# EAGLE design ZXS_I2_kartridz (EAGLE 8.6.3)
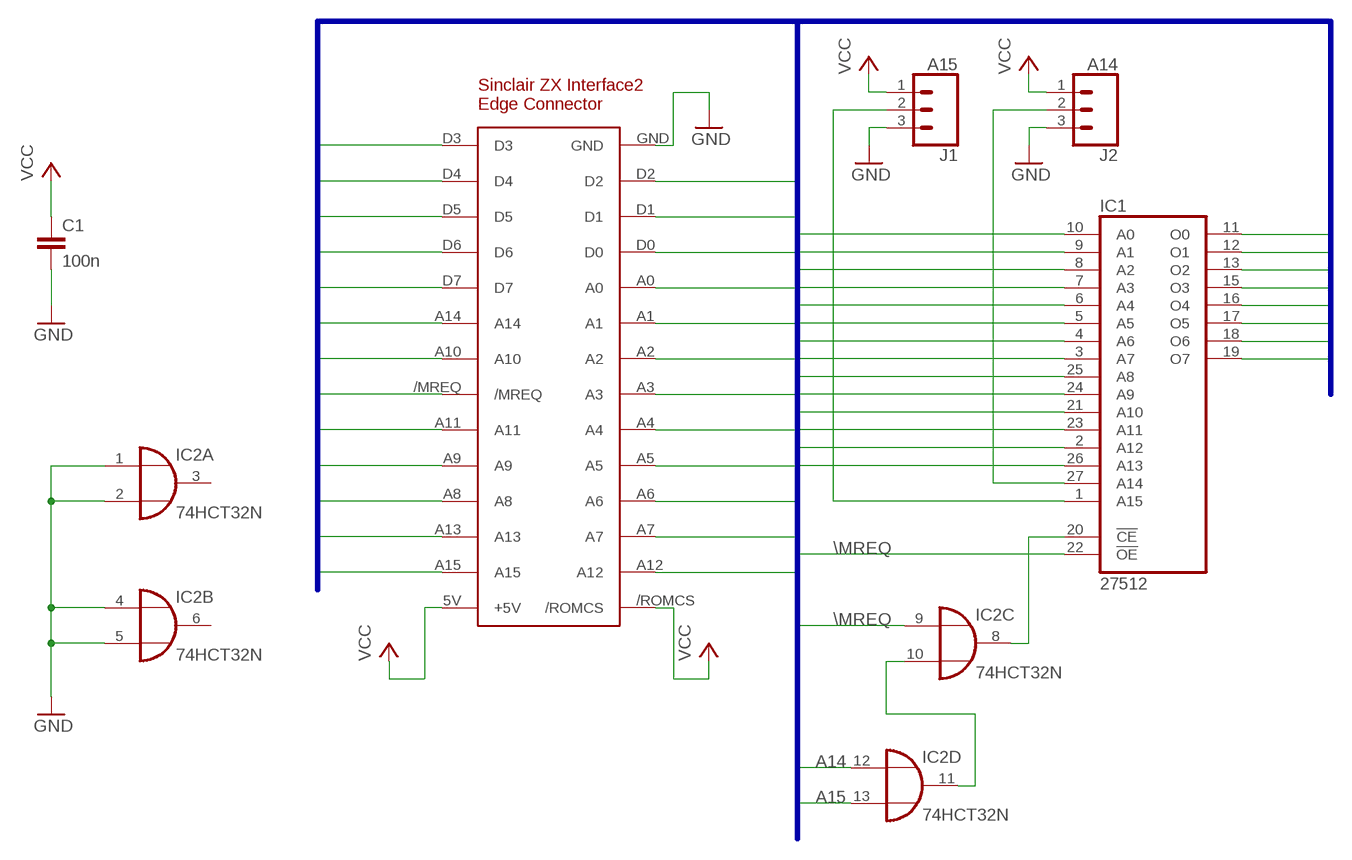
[diagram p0: schematic, sheet 1]

## Parts
C1  100n  C-EU050-024X044  [C050-024X044]
IC1  27512  [DIL28]
IC2  74HCT32N  [DIL14]
J1  A15  CONN_03  [1X03]
J2  A14  CONN_03  [1X03]
U$1  ZX_I2_ROM_EDGE_CONNECTOR  [ZX_I2_ROM_EDGE_CONNECTOR_V2]

## Nets
\MREQ: IC1.22(!OE) IC2.9(C:I0) U$1./MREQ
A0: IC1.10(A0) U$1.A0
A1: IC1.9(A1) U$1.A1
A2: IC1.8(A2) U$1.A2
A3: IC1.7(A3) U$1.A3
A4: IC1.6(A4) U$1.A4
A5: IC1.5(A5) U$1.A5
A6: IC1.4(A6) U$1.A6
A7: IC1.3(A7) U$1.A7
A8: IC1.25(A8) U$1.A8
A9: IC1.24(A9) U$1.A9
A10: IC1.21(A10) U$1.A10
A11: IC1.23(A11) U$1.A11
A12: IC1.2(A12) U$1.A12
A13: IC1.26(A13) U$1.A13
A14: IC2.12(D:I0) U$1.A14
A15: IC2.13(D:I1) U$1.A15
D0: IC1.11(O0) U$1.D0
D1: IC1.12(O1) U$1.D1
D2: IC1.13(O2) U$1.D2
D3: IC1.15(O3) U$1.D3
D4: IC1.16(O4) U$1.D4
D5: IC1.17(O5) U$1.D5
D6: IC1.18(O6) U$1.D6
D7: IC1.19(O7) U$1.D7
GND: C1.2 IC2.1(A:I0) IC2.2(A:I1) IC2.4(B:I0) IC2.5(B:I1) J1.3 J2.3 U$1.GND
N$1: IC2.10(C:I1) IC2.11(D:O)
N$2: IC1.27(A14) J2.2
N$3: IC1.20(!CE) IC2.8(C:O)
N$4: IC1.1(A15) J1.2
VCC: C1.1 J1.1 J2.1 U$1.5V(+5V) U$1./ROMCS
Unconnected: IC2.3(A:O) IC2.6(B:O)

## Buses
A[0..15],D[0..7],\MREQ

## Power pins joined to a net without a drawn wire
GND: IC1.14(GND) IC2.7(P:GND)
VCC: IC1.28(VCC) IC2.14(P:VCC)

## Library data of the parts
C1 = rcl:C-EU: CAPACITOR, European symbol; SPICEPREFIX: C
IC1 = memory:27512: MEMORY
IC2 = 74xx-eu:74*32: Quad 2-input OR gate
J1 J2 = SparkFun-Connectors:CONN_03: Multi connection point. Often used as Generic Header-pin footprint for 0.1 inch spaced/style header connections On any of the 0.1 inch spaced packages, you can populate with these: Break Away Headers - Straight <https://www.sparkfun.com/products/116> (PRT-00116) Break Away Male Headers - Right Angle <https://www.sparkfun.com/products/553> (PRT-00553) Female Headers <https://www.sparkfun.com/products/115> (PRT-00115) Break Away Headers - Machine Pin <https://www.sparkfun.com/products/117> (PRT-00117) Break Away Female Headers - Swiss Machine Pin <https://www.sparkfun.com/products/743> (PRT-00743) Stackable Header - 3 Pin (Female, 0.1") <https://www.sparkfun.com/products/13875> (PRT-13875) For SCREWTERMINALS and SPRING TERMINALS visit here: Screw Terimnals on SparkFun.com <https://www.sparkfun.com/search/results?term=Screw+Terminals> (5mm/3.5mm/2.54mm spacing) This device is also useful as a general connection point to wire up your design to another part of your project. Our various solder wires solder well into these plated through hole pads. Hook-Up Wire - Assortment (Stranded, 22 AWG) <https://www.sparkfun.com/products/11375> (PRT-11375) Hook-Up Wire - Assortment (Solid Core, 22 AWG) <https://www.sparkfun.com/products/11367> (PRT-11367) View the entire wire category on our website here <https://www.sparkfun.com/categories/141> Special notes: Molex polarized connector foot print use with SKU : PRT-08232 with associated crimp pins and housings.
U$1 = zxs_i2_rom_edge_connector:ZX_I2_ROM_EDGE_CONNECTOR

## Board
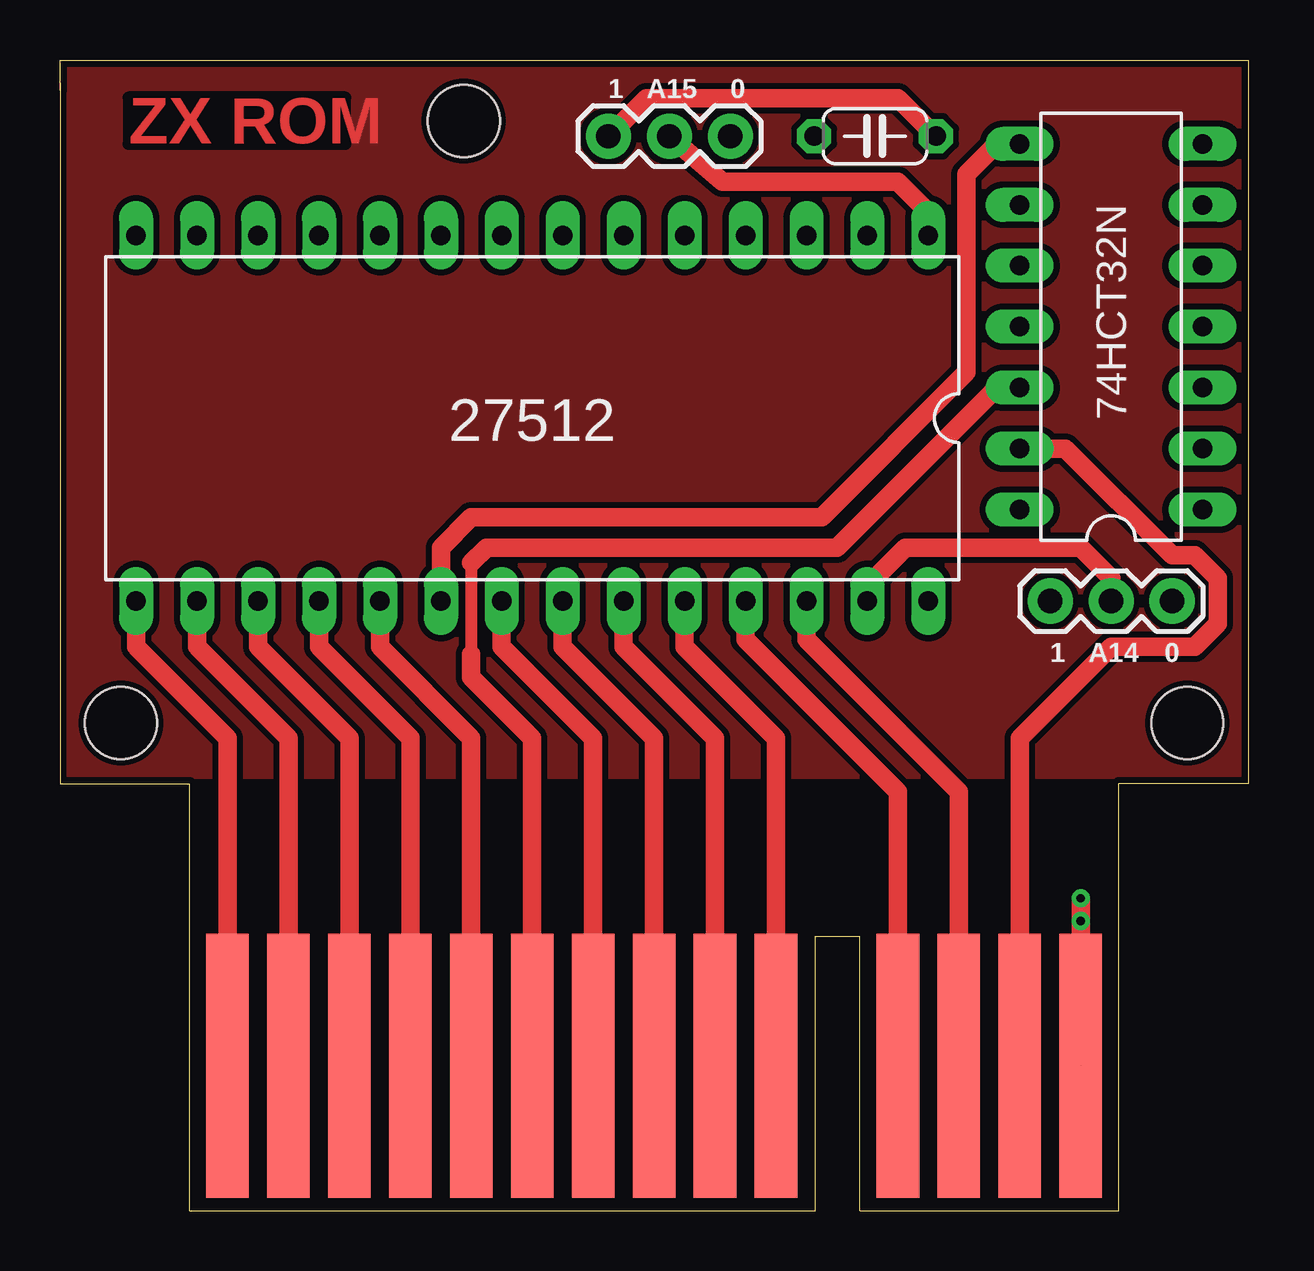
[diagram p1: board, top side]
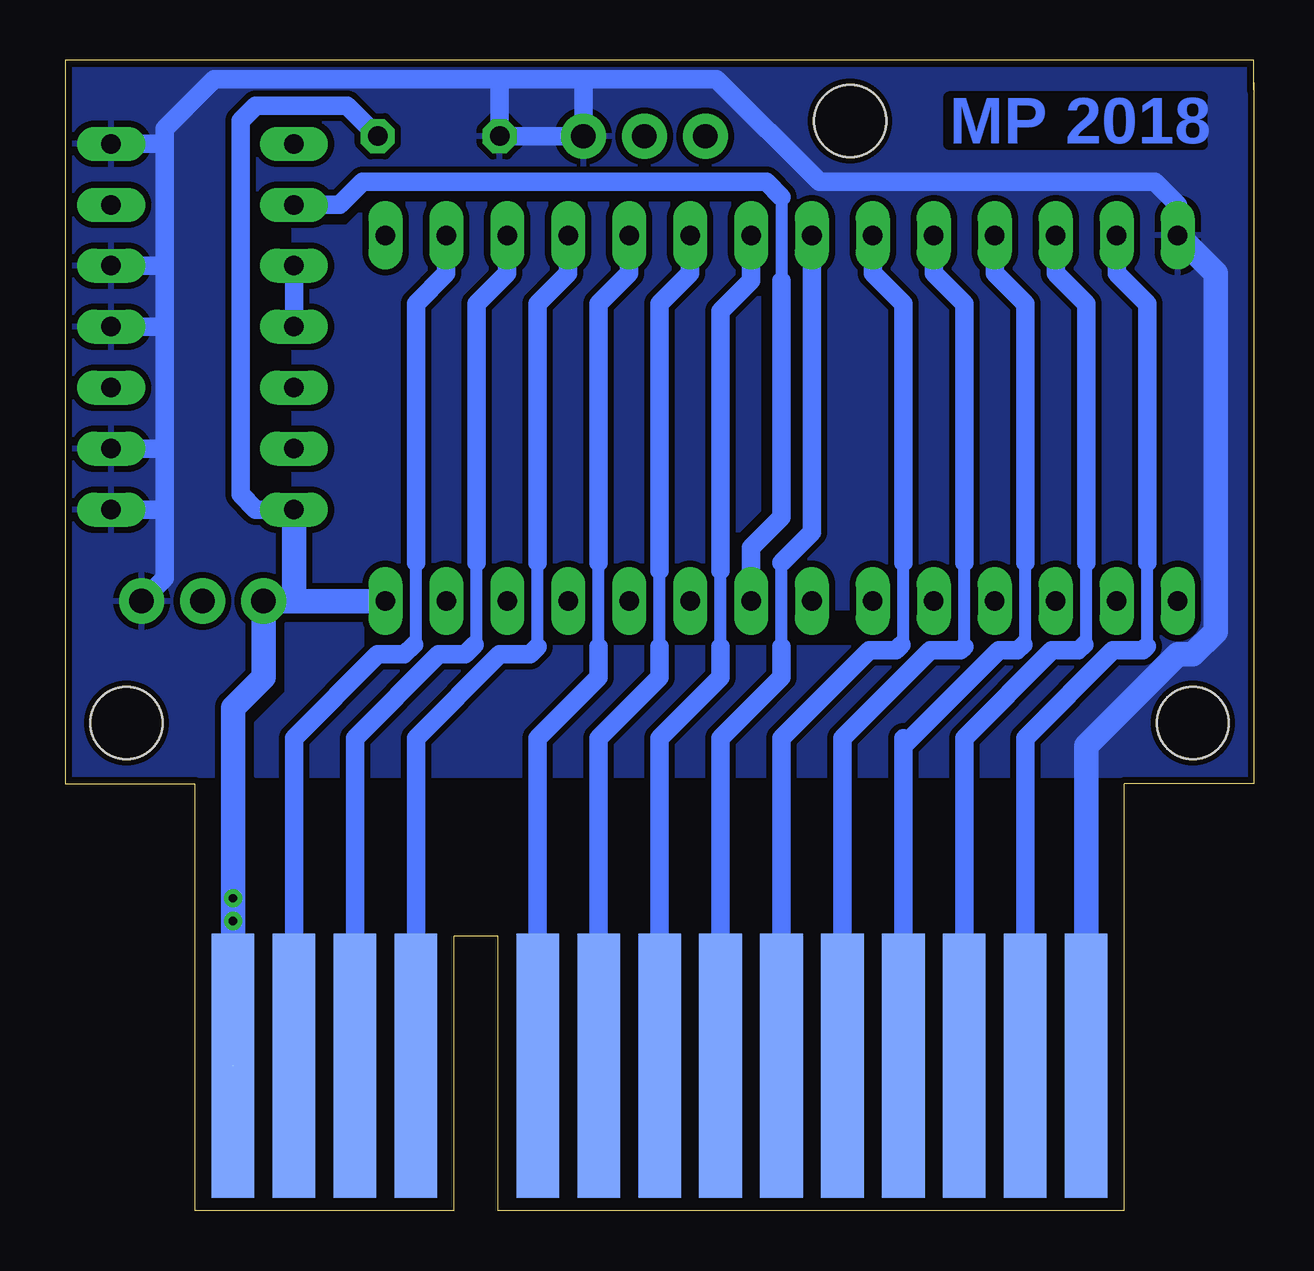
[diagram p2: board, bottom side, seen from below]

Size 49.53 x 47.94 mm. Coordinates in mm from the lower left corner, seen from the top.
Outline: 0,46.99 0,46.67
Outline: 0,46.67 0,17.78 5.4,17.78 5.4,0 31.5,0 31.5,11.43 33.34,11.43 33.34,0 44.13,0 44.13,17.78 49.53,17.78 49.53,47.94 0,47.94 0,46.67
Copper layers (1*16): Top 0.035mm / dielectric 1.5mm / Bottom 0.035mm
Design rules "moje_1 *": minimum track width 10mil, minimum drill 0.35mm, track to track 10mil, track to pad 10mil, pad to pad 10mil, via to via 10mil, smd to smd 6mil, copper to edge 10mil, drill to drill 6mil, minimum pad ring 12mil, minimum via ring 8mil, stop-mask expansion 4mil, vias tented up to drill 0mil, thermal gap 10mil
Holes 3 mm at 2.54,20.32 46.99,20.32 16.83,45.4

### Footprints (pad centres in the part's own frame; a part is rotated, then mirrored left to right if it is on the bottom)
C050-024X044 = drill 0.813 octagon: 1 -2.54,0; 2 2.54,0
DIL28 = drill 0.813 long: 1 -16.51,-7.62; 2 -13.97,-7.62; 3 -11.43,-7.62; 4 -8.89,-7.62; 5 -6.35,-7.62; 6 -3.81,-7.62; 7 -1.27,-7.62; 8 1.27,-7.62; 9 3.81,-7.62; 10 6.35,-7.62; 11 8.89,-7.62; 12 11.43,-7.62; 13 13.97,-7.62; 14 16.51,-7.62; 15 16.51,7.62; 16 13.97,7.62; 17 11.43,7.62; 18 8.89,7.62; 19 6.35,7.62; 20 3.81,7.62; 21 1.27,7.62; 22 -1.27,7.62; 23 -3.81,7.62; 24 -6.35,7.62; 25 -8.89,7.62; 26 -11.43,7.62; 27 -13.97,7.62; 28 -16.51,7.62
DIL14 = drill 0.813 long: 1 -7.62,-3.81; 2 -5.08,-3.81; 3 -2.54,-3.81; 4 0,-3.81; 5 2.54,-3.81; 6 5.08,-3.81; 7 7.62,-3.81; 8 7.62,3.81; 9 5.08,3.81; 10 2.54,3.81; 11 0,3.81; 12 -2.54,3.81; 13 -5.08,3.81; 14 -7.62,3.81
1X03 = drill 1.016 pad 1.88: 1 0,0; 2 2.54,0; 3 5.08,0
ZX_I2_ROM_EDGE_CONNECTOR_V2 = smd 1.778 x 11: 5V 10.16,5.08; /MREQ -7.62,5.08; A8 2.54,5.08; A9 -2.54,5.08; A10 -10.16,5.08; A11 -5.08,5.08; A13 5.08,5.08; A14 -12.7,5.08; A15 7.62,5.08; D3 -25.4,5.08; D4 -22.86,5.08; D5 -20.32,5.08; D6 -17.78,5.08; D7 -15.24,5.08 | smd 1.778 x 11 bottom: /ROMCS 10.16,5.08; A0 -15.24,5.08; A1 -12.7,5.08; A2 -10.16,5.08; A3 -7.62,5.08; A4 -5.08,5.08; A5 -2.54,5.08; A6 2.54,5.08; A7 5.08,5.08; A12 7.62,5.08; D0 -17.78,5.08; D1 -20.32,5.08; D2 -22.86,5.08; GND -25.4,5.08

### Placement (x,y rotation side)
C1  33.97,44.77 180 top
IC1  19.68,33.02 180 top
IC2  43.81,36.83 90 top
J1  22.86,44.77 0 top
J2  41.27,25.4 0 top
U$1  32.38,0.95 0 top

### Tracks (layer width: path | path; a pad name or v marks a point on that pad's centre or on a via)
\MREQ
  Top 0.762: U$1./MREQ 24.77,19.68 20.95,23.5 IC1.22
  Bottom 0.508: 19.68,42.23 19.68,38.73
  Bottom 0.762: IC1.22 20.95,27.62 19.68,28.89 19.68,38.73 | 19.68,42.23 20.32,42.86 37.15,42.86 38.1,41.91 IC2.9
A0
  Bottom 0.508: 12.06,23.5 12.06,26.99
  Bottom 0.762: U$1.A0 17.14,19.68 13.49,23.34 12.22,23.34 12.06,23.5 | 12.06,26.99 12.06,37.78 13.34,39.05 IC1.10
A1
  Bottom 0.508: 14.69,23.58 14.61,23.66 14.61,26.99
  Bottom 0.762: U$1.A1 19.68,19.68 16.03,23.34 14.92,23.34 14.69,23.58 | 14.61,26.99 14.61,37.78 15.88,39.05 IC1.9
A2
  Bottom 0.508: 19.68,23.5 19.68,26.99
  Bottom 0.762: U$1.A2 22.23,19.68 19.68,22.23 19.68,23.5 | 19.68,26.99 18.41,28.26 IC1.8
A3
  Bottom 0.508: 22.23,23.5 22.23,26.67 22.23,26.99
  Bottom 0.762: U$1.A3 24.77,19.68 22.23,22.23 22.23,23.5 | 22.23,26.67 22.23,37.47 20.95,38.73 IC1.7
A4
  Bottom 0.508: 24.77,23.5 24.77,26.67 24.77,26.99
  Bottom 0.762: 26.99,6.35 U$1.A4 27.3,19.68 24.77,22.23 24.77,23.5 | 24.77,26.67 24.77,37.78 23.5,39.05 IC1.6
A5
  Bottom 0.508: 27.3,23.5 27.3,26.99
  Bottom 0.762: U$1.A5 29.84,19.68 27.3,22.23 27.3,23.5 | 27.3,26.99 27.3,37.78 26.04,39.05 IC1.5
A6
  Bottom 0.508: 29.84,23.5 29.84,26.99
  Bottom 0.762: U$1.A6 34.92,19.68 31.43,23.18 30.16,23.18 29.84,23.5 | 29.84,26.99 29.84,37.78 28.57,39.05 IC1.4
A7
  Bottom 0.508: 32.47,23.58 32.38,23.66 32.38,26.99
  Bottom 0.762: U$1.A7 37.47,19.68 33.97,23.18 32.87,23.18 32.47,23.58 | 32.38,26.99 32.38,37.78 31.11,39.05 IC1.3
A8
  Top 0.762: U$1.A8 34.92,17.46 28.57,23.81 IC1.25
A9
  Top 0.762: U$1.A9 29.84,19.68 26.04,23.5 IC1.24
A10
  Top 0.762: U$1.A10 22.23,19.68 18.41,23.5 IC1.21
A11
  Top 0.762: U$1.A11 27.3,19.68 23.5,23.5 IC1.23
A12
  Bottom 0.508: 35.01,23.58 34.92,23.66 34.92,26.99
  Bottom 0.762: U$1.A12 40.01,19.68 36.51,23.18 35.41,23.18 35.01,23.58 | 34.92,26.99 34.92,37.78 33.66,39.05 IC1.2
A13
  Top 0.762: U$1.A13 37.47,17.46 31.11,23.81 IC1.26
A14
  Top 0.508: 17.14,26.99 17.14,23.18
  Top 0.762: U$1.A14 19.68,19.68 17.14,22.23 17.14,23.18 | 17.14,26.99 17.78,27.62 32.38,27.62 39.05,34.29 IC2.12
A15
  Top 0.762: U$1.A15 40.01,19.68 43.81,23.5 47.31,23.5 48.26,24.45 48.26,26.35 47.31,27.3 46.35,27.3 41.91,31.75 IC2.13
D0
  Bottom 0.508: 9.61,23.58 9.53,23.66 9.53,26.99
  Bottom 0.762: U$1.D0 14.61,19.37 | 14.61,19.37 14.61,19.68 | 14.61,19.37 10.63,23.34 9.84,23.34 9.61,23.58 | 9.53,26.99 9.53,37.78 10.79,39.05 IC1.11
D1
  Bottom 0.508: 7.3,23.34 6.99,23.66 6.99,26.99
  Bottom 0.762: U$1.D1 12.06,19.68 8.41,23.34 7.3,23.34 7.07,23.58 | 6.99,26.99 6.99,37.78 8.26,39.05 IC1.12
D2
  Bottom 0.508: 4.46,23.51 4.45,23.52 4.45,26.99
  Bottom 0.762: U$1.D2 9.53,19.68 5.87,23.34 4.63,23.34 4.46,23.51 | 4.45,26.99 4.45,37.78 5.71,39.05 IC1.13
D3
  Top 0.762: U$1.D3 6.99,19.68 3.17,23.5 IC1.15
D4
  Top 0.762: U$1.D4 9.53,19.68 5.71,23.5 IC1.16
D5
  Top 0.762: U$1.D5 12.06,19.68 8.26,23.5 IC1.17
D6
  Top 0.762: IC1.18 10.79,23.5 14.61,19.68 U$1.D6
D7
  Top 0.762: U$1.D7 17.14,19.68 13.34,23.5 IC1.19
GND
  Bottom 0.762: J2.3 45.4,26.35 45.4,29.21 | 45.4,29.21 45.4,31.75 | 45.4,31.75 45.4,36.83 | 45.4,36.83 45.4,39.37 | 45.4,39.37 45.4,44.45 | 45.4,44.45 45.4,45.09 43.34,47.15 31.43,47.15 | IC2.7 45.4,44.45 | IC2.5 45.4,39.37 | IC2.4 45.4,36.83 | IC2.2 45.4,31.75 | IC2.1 45.4,29.21 | IC1.14 3.17,41.91 4.13,42.86 18.1,42.86 22.38,47.15 27.94,47.15 | 27.94,47.15 31.43,47.15 | 27.94,47.15 J1.3 C1.2 31.43,47.15
  Bottom 1.016: IC1.14 1.59,39.05 1.59,24.13 2.54,23.18 3.17,23.18 6.99,19.37 U$1.GND
  pour Bottom (isolate 0.254): 0.32,47.62 0.32,18.1 9.53,18.1 9.53,19.68 4.45,24.77 4.45,25.08 22.23,25.08 22.23,26.67 21.91,26.67 19.68,28.89 19.68,42.55 20,42.86 37.78,42.86 39.05,41.59 40.01,41.59 42.86,41.59 42.86,29.53 41.27,29.53 40.64,28.89 40.64,25.72 41.59,24.77 41.59,21.91 43.18,20.32 43.18,18.1 49.21,18.1 49.21,47.62
N$1
  Bottom 0.762: IC2.10 IC2.11
N$2
  Top 0.762: J2.2 43.81,26.35 42.55,27.62 35.24,27.62 33.66,26.04 IC1.27
N$3
  Top 0.762: IC2.8 39.05,44.45 37.78,43.18 37.78,34.92 31.75,28.89 17.14,28.89 15.88,27.62 IC1.20
N$4
  Top 0.762: IC1.1 36.2,41.59 34.92,42.86 27.62,42.86 J1.2
N$5
  pour Top: 0.32,47.62 49.21,47.62 49.21,18.1 0.32,18.1
N$6
  pour Bottom: 20.95,41.91 36.83,41.91 37.78,40.96 40.01,40.96 40.01,26.04 23.81,26.04 20.64,29.21 20.64,41.59
N$7
  pour Bottom: 41.59,18.1 10.16,18.1 10.16,19.68 10.16,20 6.67,23.5 37.15,23.5 37.15,24.45 40.32,24.45 40.32,21.59 41.59,20.32
VCC  (via drill 0.35)  (1 unrouted)
  Top 0.762: U$1./ROMCS v42.55,12.06 v42.55,13.02 | C1.1 34.92,46.35 24.45,46.35 J1.1
  Bottom 0.254: U$1./ROMCS 42.55,8.89
  Bottom 0.762: v42.55,13.02 v42.55,12.06 | IC2.14 41.59,29.21 42.23,29.84 42.23,45.4 41.59,46.04 37.78,46.04 C1.1
  Bottom 1.016: 42.55,8.89 42.55,20.95 41.27,22.23 J2.1 40.32,25.4 | 40.32,25.4 IC1.28 | IC2.14 40.01,25.72 40.32,25.4

### Text on the board
Top: ZX ROM
Bottom: MP 2018
tPlace: 1 | A15 | 0 | 27512 | 1 | A14 | 0
tValues: 1 | A15 | 0 | 1 | A14 | 0